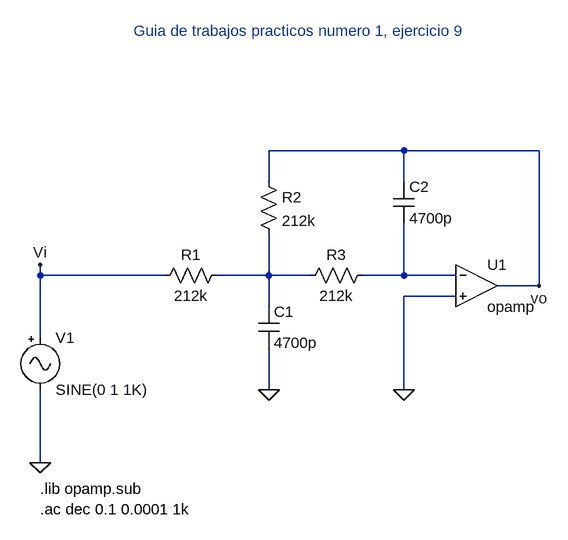
[diagram p0: schematic tp_1_9.asc]
tp_1_9.asc, the LTspice schematic file:
Version 4
SHEET 1 1112 680
WIRE 576 48 368 48
WIRE 784 48 576 48
WIRE 368 96 368 48
WIRE 576 96 576 48
WIRE 16 240 16 224
WIRE 208 240 16 240
WIRE 368 240 368 176
WIRE 368 240 288 240
WIRE 432 240 368 240
WIRE 576 240 576 160
WIRE 576 240 512 240
WIRE 656 240 576 240
WIRE 784 256 784 48
WIRE 784 256 720 256
WIRE 656 272 576 272
WIRE 368 288 368 240
WIRE 16 336 16 240
WIRE 368 416 368 352
WIRE 576 416 576 272
WIRE 16 528 16 416
FLAG 16 528 0
FLAG 16 224 Vi
FLAG 368 416 0
FLAG 576 416 0
FLAG 784 256 vo
SYMBOL Misc/signal 16 320 R0
SYMATTR InstName V1
SYMATTR Value2 AC 1
SYMBOL res 304 224 R90
WINDOW 0 0 56 VBottom 2
WINDOW 3 32 56 VTop 2
SYMATTR InstName R1
SYMATTR Value 212k
SYMBOL res 352 80 R0
SYMATTR InstName R2
SYMATTR Value 212k
SYMBOL res 528 224 R90
WINDOW 0 0 56 VBottom 2
WINDOW 3 32 56 VTop 2
SYMATTR InstName R3
SYMATTR Value 212k
SYMBOL cap 352 288 R0
SYMATTR InstName C1
SYMATTR Value 4700p
SYMBOL cap 560 96 R0
SYMATTR InstName C2
SYMATTR Value 4700p
SYMBOL Opamps/opamp 688 192 R0
SYMATTR InstName U1
TEXT 16 568 Left 2 !.lib opamp.sub
TEXT 16 600 Left 2 !.ac dec 0.1 0.0001 1k
TEXT 160 -136 Left 2 ;Guia de trabajos practicos numero 1, ejercicio 9

The netlist it stands for:
* tp_1_9.asc
V1 Vi 0 SINE(0 1 1K) AC 1
R1 N001 Vi 212k
R2 vo N001 212k
R3 N002 N001 212k
C1 N001 0 4700p
C2 vo N002 4700p
XU1 N002 0 vo opamp Aol=100K GBW=10Meg  ; pins invin noninvin out
.lib opamp.sub
.ac dec 0.1 0.0001 1k
* Guia de trabajos practicos numero 1, ejercicio 9
.backanno
.end